# Altium schematic sheet S7CAS-PLEIADES-CARTE-MERE_P20_Sensors-Actuators-FPGA-Bank-1.SchDoc
size Tabloid; Sheet_Name: Sensors Actuators FPGA Bank 1; Size: 11x17
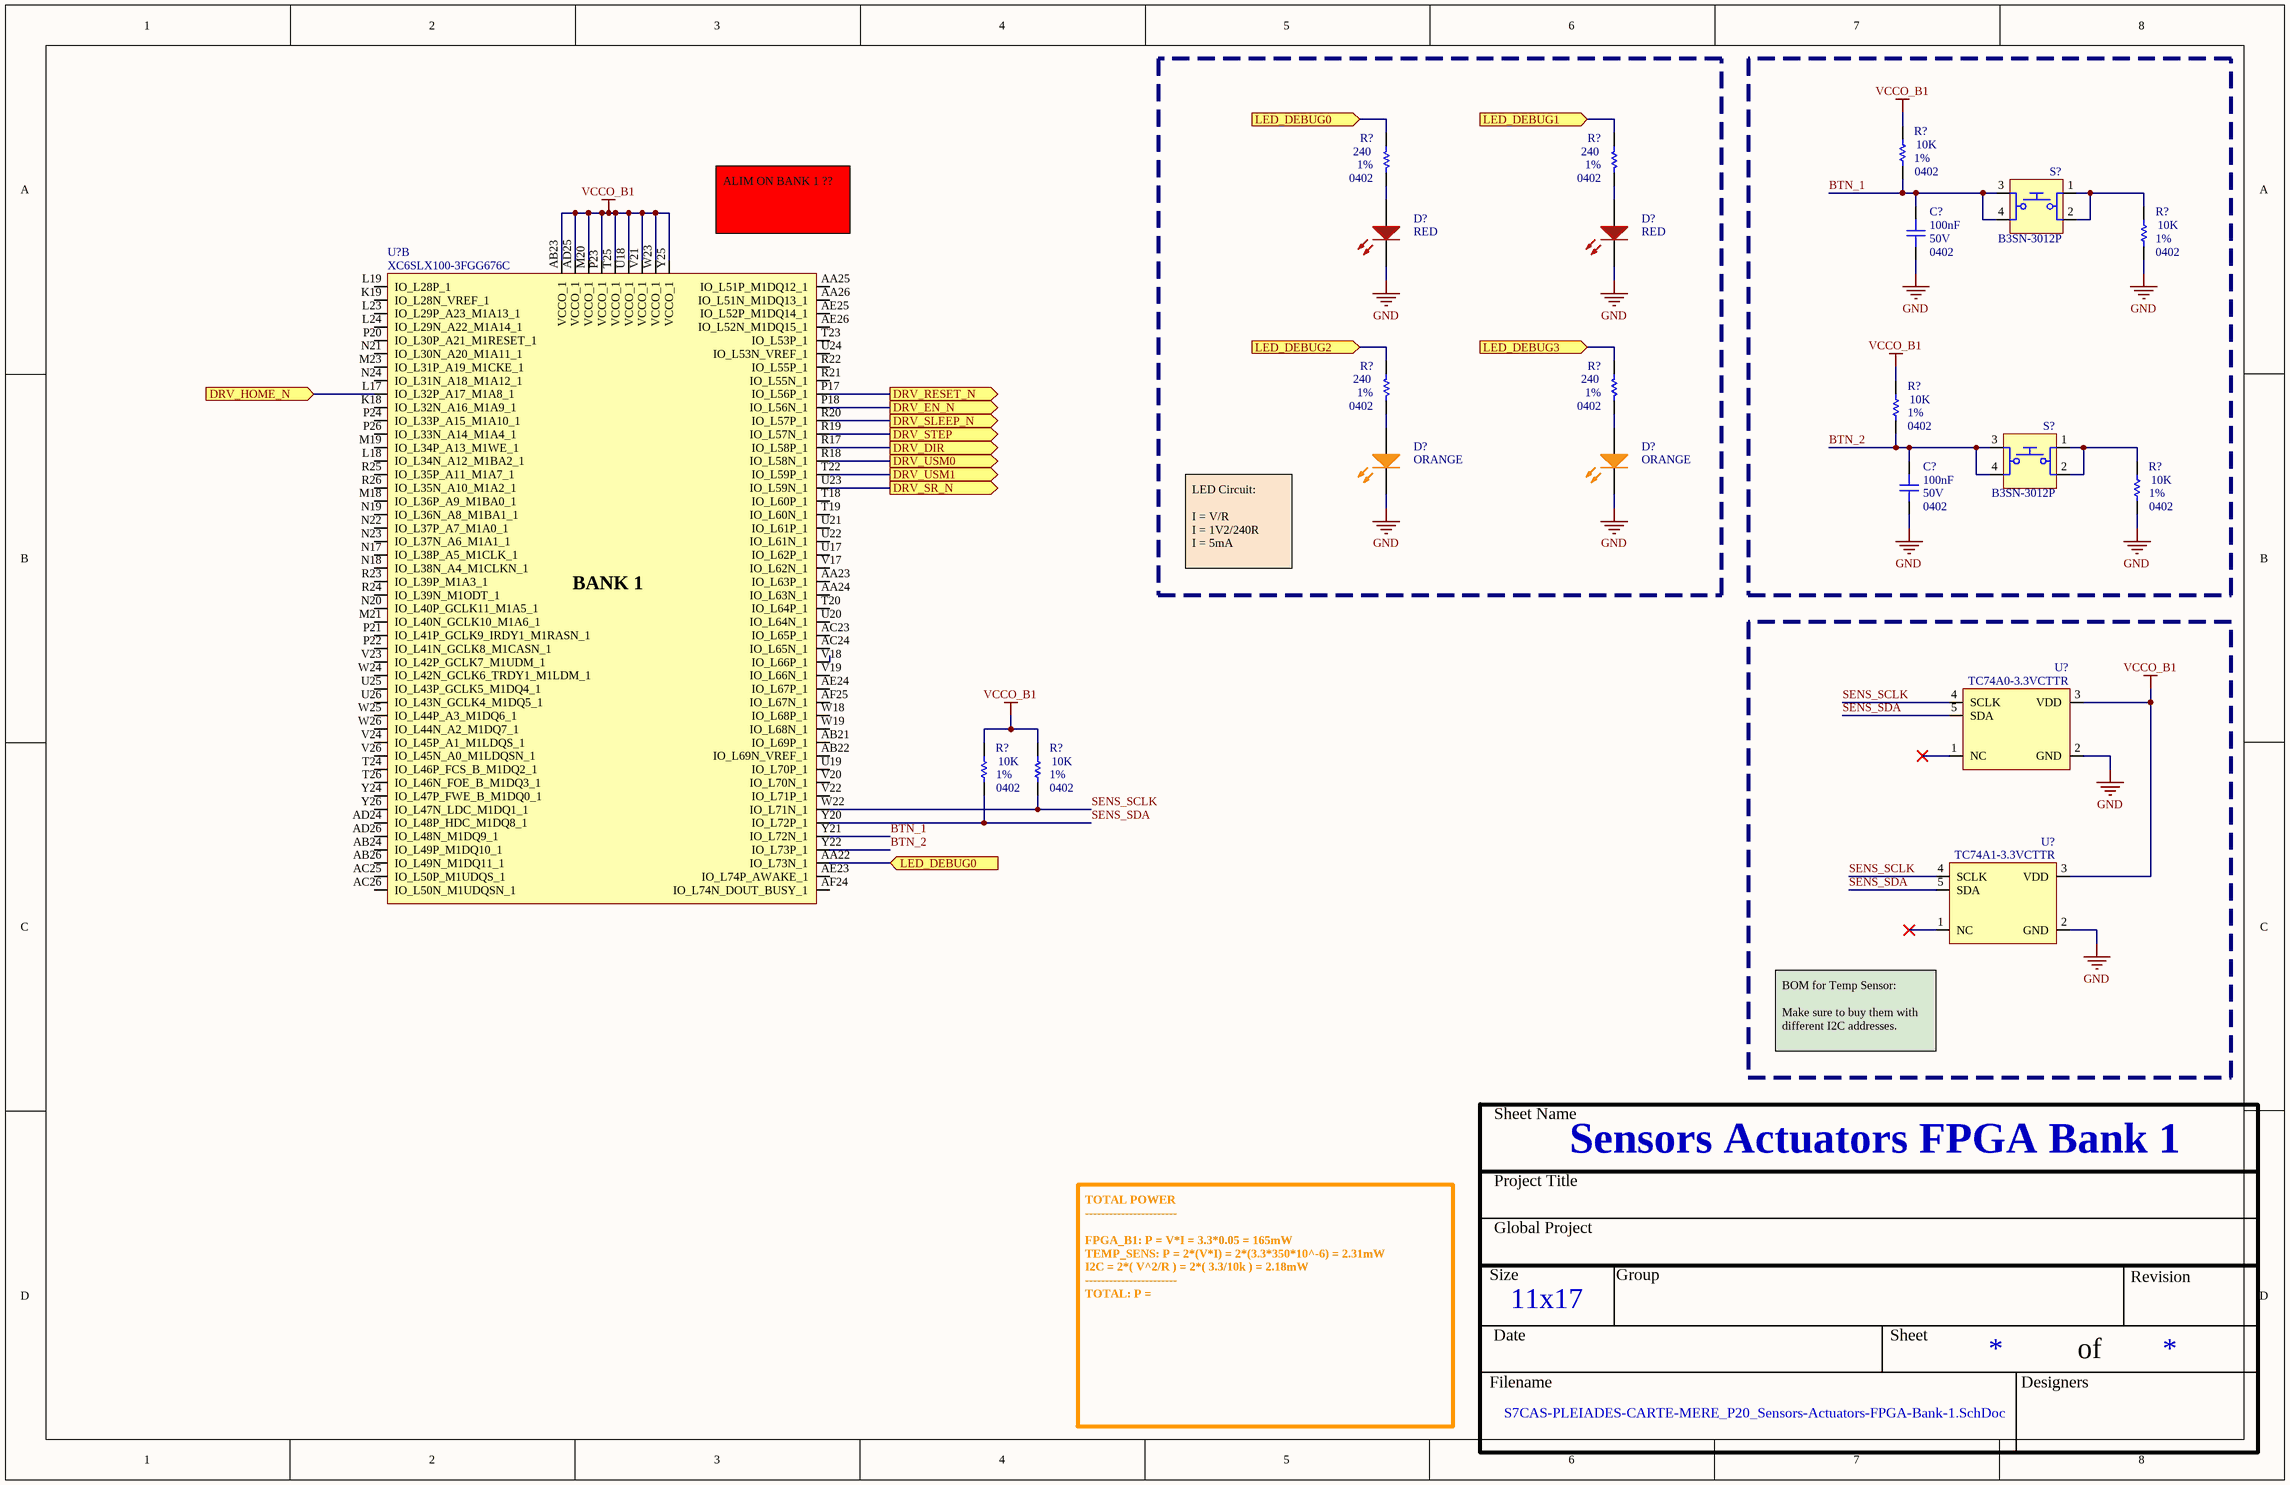
[diagram p0: S7CAS-PLEIADES-CARTE-MERE_P20_Sensors-Actuators-FPGA-Bank-1.SchDoc]

## Parts
(Parts that share a designator on the sheet are numbered #1, #2 ... from top to bottom, then left to right.)
C?#1  value 100nF  Voltage: 50V  Package: 0402  [CAP_0201]  (hidden comment: CAP - 0201)
C?#2  value 100nF  Voltage: 50V  Package: 0402  [CAP_0201]  (hidden comment: CAP - 0201)
D?#1  value RED  [LED_0603]  (hidden comment: SML-311UTT86)
D?#2  value RED  [LED_0603]  (hidden comment: SML-311UTT86)
D?#3  value ORANGE  [LED_0603]  (hidden comment: SML-311DTT86)
D?#4  value ORANGE  [LED_0603]  (hidden comment: SML-311DTT86)
R?#1  value 10K  Package: 0402  Precision: 1%  [RES_0402]  (hidden comment: RES - 0402)
R?#2  value 240  Package: 0402  Precision: 1%  [RES_0402]  (hidden comment: RES - 0402)
R?#3  value 240  Package: 0402  Precision: 1%  [RES_0402]  (hidden comment: RES - 0402)
R?#4  value 10K  Package: 0402  Precision: 1%  [RES_0402]  (hidden comment: RES - 0402)
R?#5  value 240  Package: 0402  Precision: 1%  [RES_0402]  (hidden comment: RES - 0402)
R?#6  value 240  Package: 0402  Precision: 1%  [RES_0402]  (hidden comment: RES - 0402)
R?#7  value 10K  Package: 0402  Precision: 1%  [RES_0402]  (hidden comment: RES - 0402)
R?#8  value 10K  Package: 0402  Precision: 1%  [RES_0402]  (hidden comment: RES - 0402)
R?#9  value 10K  Package: 0402  Precision: 1%  [RES_0402]  (hidden comment: RES - 0402)
R?#10  value 10K  Package: 0402  Precision: 1%  [RES_0402]  (hidden comment: RES - 0402)
S?#1  B3SN-3012P  [SWI_TACT_B3SN-3012P]
S?#2  B3SN-3012P  [SWI_TACT_B3SN-3012P]
U?#1  XC6SLX100-3FGG676C  [FPGA_XILINX_FGG676]  (part B of 10)
U?#2  TC74A0-3.3VCTTR  [SEN_TEMP_TC74A0-3.3VCTTR]
U?#3  TC74A1-3.3VCTTR  [SEN_TEMP_TC74A0-3.3VCTTR]

## Ports
DRV_DIR (out), DRV_EN_N (out), DRV_HOME_N (in), DRV_RESET_N (out), DRV_SLEEP_N (out), DRV_SR_N (out), DRV_STEP (out), DRV_USM0 (out), DRV_USM1 (out), LED_DEBUG0 (in), LED_DEBUG1 (in), LED_DEBUG2 (in), LED_DEBUG3 (in)

## Nets
GND: C?#1.1 C?#2.1 D?#1.K D?#2.K D?#3.K D?#4.K R?#4.1 R?#8.1 U?#2.2(GND) U?#3.2(GND)
VCCO_B1: R?#1.2 R?#7.2 R?#9.2 R?#10.2 U?#1.AB23(VCCO_1) U?#1.AD25(VCCO_1) U?#1.M20(VCCO_1) U?#1.P23(VCCO_1) U?#1.T25(VCCO_1) U?#1.U18(VCCO_1) U?#1.V21(VCCO_1) U?#1.W23(VCCO_1) U?#1.Y25(VCCO_1) U?#2.3(VDD) U?#3.3(VDD)
BTN_1: C?#1.2 R?#1.1 S?#1.3 S?#1.4 U?#1.Y21(IO_L72N_1)
BTN_2: C?#2.2 R?#7.1 S?#2.3 S?#2.4 U?#1.Y22(IO_L73P_1)
DRV_DIR: U?#1.R17(IO_L58P_1) ; port DRV_DIR
DRV_EN_N: U?#1.P18(IO_L56N_1) ; port DRV_EN_N
DRV_HOME_N: U?#1.L17(IO_L32P_A17_M1A8_1) ; port DRV_HOME_N
DRV_RESET_N: U?#1.P17(IO_L56P_1) ; port DRV_RESET_N
DRV_SLEEP_N: U?#1.R20(IO_L57P_1) ; port DRV_SLEEP_N
DRV_SR_N: U?#1.U23(IO_L59N_1) ; port DRV_SR_N
DRV_STEP: U?#1.R19(IO_L57N_1) ; port DRV_STEP
DRV_USM0: U?#1.R18(IO_L58N_1) ; port DRV_USM0
DRV_USM1: U?#1.T22(IO_L59P_1) ; port DRV_USM1
LED_DEBUG0: R?#2.2 U?#1.AA22(IO_L73N_1) ; port LED_DEBUG0
LED_DEBUG1: R?#3.2 ; port LED_DEBUG1
LED_DEBUG2: R?#5.2 ; port LED_DEBUG2
LED_DEBUG3: R?#6.2 ; port LED_DEBUG3
SENS_SCLK: R?#10.1 U?#1.W22(IO_L71N_1) U?#2.4(SCLK) U?#3.4(SCLK)
SENS_SDA: R?#9.1 U?#1.Y20(IO_L72P_1) U?#2.5(SDA) U?#3.5(SDA)
NetD?#1_A: D?#1.A R?#2.1
NetD?#2_A: D?#2.A R?#3.1
NetD?#3_A: D?#3.A R?#5.1
NetD?#4_A: D?#4.A R?#6.1
NetR?#4_2: R?#4.2 S?#1.1 S?#1.2
NetR?#8_2: R?#8.2 S?#2.1 S?#2.2

Not connected (* = marked no-connect by the designer): U?#1 AA23(IO_L63P_1) AA24(IO_L63N_1) AA25(IO_L51P_M1DQ12_1) AA26(IO_L51N_M1DQ13_1) AB21(IO_L69P_1) AB22(IO_L69N_VREF_1) AB24(IO_L49P_M1DQ10_1) AB26(IO_L49N_M1DQ11_1) AC23(IO_L65P_1) AC24(IO_L65N_1) AC25(IO_L50P_M1UDQS_1) AC26(IO_L50N_M1UDQSN_1) AD24(IO_L48P_HDC_M1DQ8_1) AD26(IO_L48N_M1DQ9_1) AE23(IO_L74P_AWAKE_1) AE24(IO_L67P_1) AE25(IO_L52P_M1DQ14_1) AE26(IO_L52N_M1DQ15_1) AF24(IO_L74N_DOUT_BUSY_1) AF25(IO_L67N_1) K18(IO_L32N_A16_M1A9_1) K19(IO_L28N_VREF_1) L18(IO_L34N_A12_M1BA2_1) L19(IO_L28P_1) L23(IO_L29P_A23_M1A13_1) L24(IO_L29N_A22_M1A14_1) M18(IO_L36P_A9_M1BA0_1) M19(IO_L34P_A13_M1WE_1) M21(IO_L40N_GCLK10_M1A6_1) M23(IO_L31P_A19_M1CKE_1) N17(IO_L38P_A5_M1CLK_1) N18(IO_L38N_A4_M1CLKN_1) N19(IO_L36N_A8_M1BA1_1) N20(IO_L40P_GCLK11_M1A5_1) N21(IO_L30N_A20_M1A11_1) N22(IO_L37P_A7_M1A0_1) N23(IO_L37N_A6_M1A1_1) N24(IO_L31N_A18_M1A12_1) P20(IO_L30P_A21_M1RESET_1) P21(IO_L41P_GCLK9_IRDY1_M1RASN_1) P22(IO_L41N_GCLK8_M1CASN_1) P24(IO_L33P_A15_M1A10_1) P26(IO_L33N_A14_M1A4_1) R21(IO_L55N_1) R22(IO_L55P_1) R23(IO_L39P_M1A3_1) R24(IO_L39N_M1ODT_1) R25(IO_L35P_A11_M1A7_1) R26(IO_L35N_A10_M1A2_1) T18(IO_L60P_1) T19(IO_L60N_1) T20(IO_L64P_1) T23(IO_L53P_1) T24(IO_L46P_FCS_B_M1DQ2_1) T26(IO_L46N_FOE_B_M1DQ3_1) U17(IO_L62P_1) U19(IO_L70P_1) U20(IO_L64N_1) U21(IO_L61P_1) U22(IO_L61N_1) U24(IO_L53N_VREF_1) U25(IO_L43P_GCLK5_M1DQ4_1) U26(IO_L43N_GCLK4_M1DQ5_1) V17(IO_L62N_1) V18(IO_L66P_1) V19(IO_L66N_1) V20(IO_L70N_1) V22(IO_L71P_1) V23(IO_L42P_GCLK7_M1UDM_1) V24(IO_L45P_A1_M1LDQS_1) V26(IO_L45N_A0_M1LDQSN_1) W18(IO_L68P_1) W19(IO_L68N_1) W24(IO_L42N_GCLK6_TRDY1_M1LDM_1) W25(IO_L44P_A3_M1DQ6_1) W26(IO_L44N_A2_M1DQ7_1) Y24(IO_L47P_FWE_B_M1DQ0_1) Y26(IO_L47N_LDC_M1DQ1_1); U?#2 1(NC)*; U?#3 1(NC)*

## Notes on the sheet
- (near U?#1) ALIM ON BANK 1 ??
- LED Circuit:
  I = V/R
  I = 1V2/240R
  I = 5mA
- (near U?#3) BOM for Temp Sensor:
  Make sure to buy them with different I2C addresses.
- TOTAL POWER
  -----------------------
  FPGA_B1: P = V*I = 3.3*0.05 = 165mW
  TEMP_SENS: P = 2*(V*I) = 2*(3.3*350*10^-6) = 2.31mW
  I2C = 2*( V^2/R ) = 2*( 3.3/10k ) = 2.18mW
  -----------------------
  TOTAL: P =
- Sheet Name
- Project Title
- Global Project
- Size
- Group
- Revision
- Date
- Sheet
- of
- Filename
- Designers
- (in symbol FPGA_XC6SLX100-3FGG676C, part B) BANK 1

## Library data of the parts
C?#1 C?#2 = CAP - 0201: Mfg Part Number: GRM155R61H104KE14; Precision: 10%; Current: *; CreatedBy: Jonathan Bouchard; Power: *
D?#1 D?#2 = LED_SML-311UTT86: LED - 620nM RED 2mA - 0603; Voltage: 1.8V; Mfg: ROHM Semiconductor; Power: 44mW; Current: 2mA; HelpURL: http://media.digikey.com/pdf/Data%20Sheets/Rohm%20PDFs/SML-311%20Series.pdf; CreatedBy: Jonathan Bouchard; Temperature: -30°C to 85°C; Package: 0603; Precision: *; Mfg Part Number: SML-311UTT86; Supplier 1: Digikey; Supplier Part Number 1: 511-1304-1-ND
D?#3 D?#4 = LED_SML-311DTT86: LED - 611nM ORANGE 2mA - 0603; Voltage: 1.8V; Mfg: ROHM Semiconductor; Power: 44mW; Current: 2mA; HelpURL: http://media.digikey.com/pdf/Data%20Sheets/Rohm%20PDFs/SML-311%20Series.pdf; CreatedBy: Jonathan Bouchard; Temperature: -40°C to 85°C; Package: 0603; Precision: *; Mfg Part Number: SML-311DTT86; Supplier 1: Digikey; Supplier Part Number 1: 511-1303-1-ND
R?#1 R?#4 R?#7-R?#10 = RES - 0402: Mfg Part Number: MCS04020C1002FE000; Voltage: 50V; Power: 1/16W; Current: *; CreatedBy: Jonathan Bouchard
R?#2 R?#3 R?#5 R?#6 = RES - 0402: Mfg Part Number: ERA-2AEB241X; Voltage: 50V; Power: 1/2W; Current: *; CreatedBy: Jonathan Bouchard
S?#1 S?#2 = SWI_TACT_B3SN-3012P_1: SWI - SWITCH TACTILE SPST-NO 0.05A 24V -SMD; Manufacturer #1: Omron Electronics Inc-EMC Div; Current Rating: 50mA; Voltage rating: 24VDC; Polarized: No; Magnetic Material: UNKNOWN; GRAMS Lib Spec: 2.8; Manufacturer #2: *; Power Max: *; Value: SPST-NO; Part Number #1: B3SN-3012P; Part Number #2: *; HelpURL: http://omronfs.omron.com/en_US/ecb/products/pdf/en-b3sn.pdf; Supplier 1: Digi-Key; Supplier Part Number 1: SW261CT-ND; Assembly Type: SMD; Temperature: -25°C ~ 70°C; Package: SMD; CreatedBy/Date: Olivier Bernard / 5/12/2017; Tolerance: *; VerifiedBy: Caroline Paulin / 11 juillet 2018; Cryo: UNKNOWN
U?#1 = FPGA_XC6SLX100-3FGG676C: FPGA - XILINX SPARTAN 6 480 I/O - BGA-676; Voltage: 1.14 V ~ 1.26 V; Current: *; Power: *; Mfg: Xilinx; Mfg Part Number: XC6SLX100-3FGG676C; HelpURL: https://www.xilinx.com/support/documentation/data_sheets/ds162.pdf; CreatedBy: Jonathan Bouchard; Temperature: 0°C ~ 85°C (TJ); Value: *; Precision: *; Package: BGA-676; Supplier 1: Digikey; Supplier Part Number 1: 122-1760-ND
U?#2 U?#3 = SENS_TEMP_TC74A0-3.3VCTTR: SENS - TEMPERATURE SENSOR I2C/SMBUS - SOT23-5; Voltage: 2.7 V ~ 5.5 V; Mfg: Microchip; Precision: ±2°C (±3°C); Current: *; Power: *; Mfg Part Number: TC74A0-3.3VCTTR; HelpURL: http://ww1.microchip.com/downloads/en/DeviceDoc/21462D.pdf; CreatedBy: Jonathan Bouchard; Temperature: -40°C ~ 125°C; Value: *; Package: SOT23-5; Supplier 1: Digikey; Supplier Part Number 1: TC74A0-3.3VCTDKR-ND